# EAGLE design OLM-periph-ether_v0.2 (EAGLE 6.4)
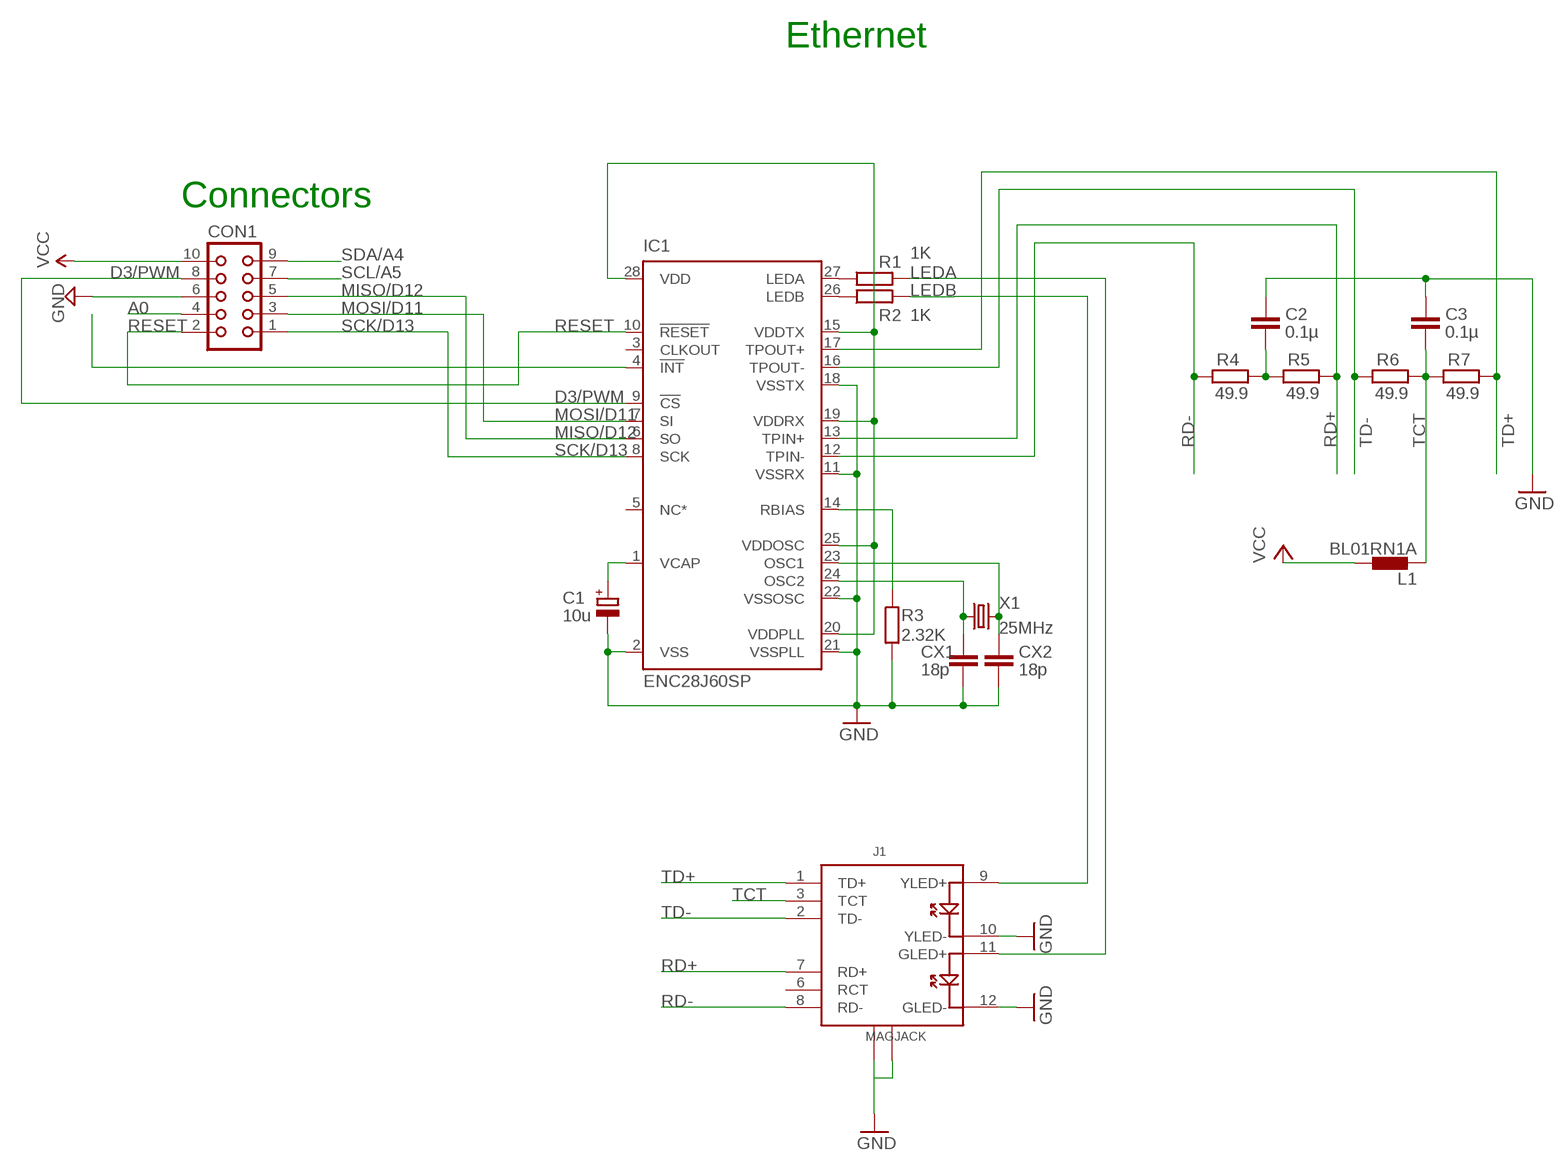
[diagram p0: schematic, sheet 1]

## Parts
C1  10u  CPOL-EUE1.8-4  [E1,8-4]
C2  0.1µ  C-EU025-024X044  [C025-024X044]
C3  0.1µ  C-EU025-024X044  [C025-024X044]
CON1  CON10L  [CON10L]
CX1  18p  C-EU025-024X044  [C025-024X044]
CX2  18p  C-EU025-024X044  [C025-024X044]
IC1  ENC28J60SP  [DIL28-3]
J1  MAGJACK  [MAGJACK]
L1  BL01RN1A  [BL01RN1A]
R1  1K  R-EU_0204/7  [0204/7]
R2  1K  R-EU_0204/7  [0204/7]
R3  2.32K  R-EU_0204/7  [0204/7]
R4  49.9  R-EU_0204/7  [0204/7]
R5  49.9  R-EU_0204/7  [0204/7]
R6  49.9  R-EU_0204/7  [0204/7]
R7  49.9  R-EU_0204/7  [0204/7]
X1  25MHz  CRYSTALHC49US  [HC49US]

## Nets
A0: CON1.4
D3/PWM: CON1.8 IC1.9(!CS)
GND [power]: C1.- C2.1 C3.1 CON1.6 CX1.2 CX2.2 IC1.2(VSS) IC1.11(VSSRX) IC1.18(VSSTX) IC1.21(VSSPLL) IC1.22(VSSOSC) J1.12(GLED-) J1.M1(GND1) J1.M2(GND2) R3.2
LEDA: J1.11(GLED+) R1.2
LEDB: J1.9(YLED+) R2.2
MISO/D12: CON1.5 IC1.6(SO)
MOSI/D11: CON1.3 IC1.7(SI)
N$1: IC1.4(!INT)
N$36: J1.10(YLED-)
N$37: IC1.27(LEDA) R1.1
N$39: IC1.26(LEDB) R2.1
N$50: C1.+ IC1.1(VCAP)
N$51: IC1.14(RBIAS) R3.1
N$52: CX1.1 IC1.24(OSC2) X1.1
N$53: CX2.1 IC1.23(OSC1) X1.2
N$54: C2.2 R4.2 R5.1
RD+: IC1.13(TPIN+) J1.7(RD+) R5.2
RD-: IC1.12(TPIN-) J1.8(RD-) R4.1
RESET: CON1.2 IC1.10(!RESET)
SCK/D13: CON1.1 IC1.8(SCK)
SCL/A5: CON1.7
SDA/A4: CON1.9
TCT: C3.2 J1.3(TCT) L1.1 R6.2 R7.1
TD+: IC1.17(TPOUT+) J1.1(TD+) R7.2
TD-: IC1.16(TPOUT-) J1.2(TD-) R6.1
VCC [power]: CON1.10 IC1.15(VDDTX) IC1.19(VDDRX) IC1.20(VDDPLL) IC1.25(VDDOSC) IC1.28(VDD) L1.2
Unconnected: IC1.3(CLKOUT) IC1.5(NC*) J1.6(RCT)

## Notes on the sheet
- Ethernet
- Connectors

## Library data of the parts
C1 = resistor:CPOL-EU: POLARIZED CAPACITOR, European symbol
C2 C3 CX1 CX2 = resistor:C-EU: CAPACITOR, European symbol
CON1 = con-harting:CON10L: CONNECTOR; OC_FARNELL: unknown; OC_NEWARK: unknown
IC1 = microchip:ENC28J60: Stand-Alone Ethernet Controller with SPI Interface Source: http://ww1.microchip.com/downloads/en/DeviceDoc/39662c.pdf; MF: MICROCHIP; MPN: ENC28J60/SP; OC_FARNELL: 1084619; OC_NEWARK: 96K3661
J1 = SparkFun:MAGJACK
L1 = inductors:BL0: Noise Suppression Products/EMI Suppression Filters, Lead EMIFIL(R) Inductor Type Source: http://www.murata.com .. BL01RN1_DS.pdf
R1-R7 = rcl:R-EU_: RESISTOR, European symbol
X1 = SparkFun:CRYSTAL: Crystals Various standard crystals. Proven footprints. Spark Fun Electronics SKU : COM-00534

## Net classes
1 power: width 0.813 mm, clearance 0.203 mm

## Board
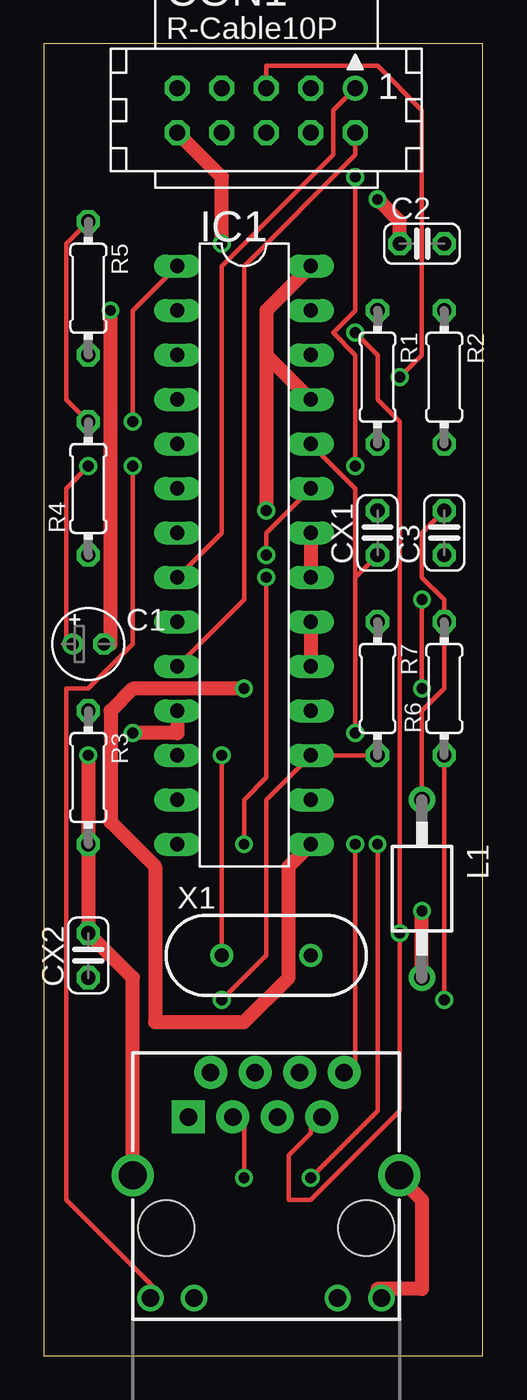
[diagram p1: board, top side]
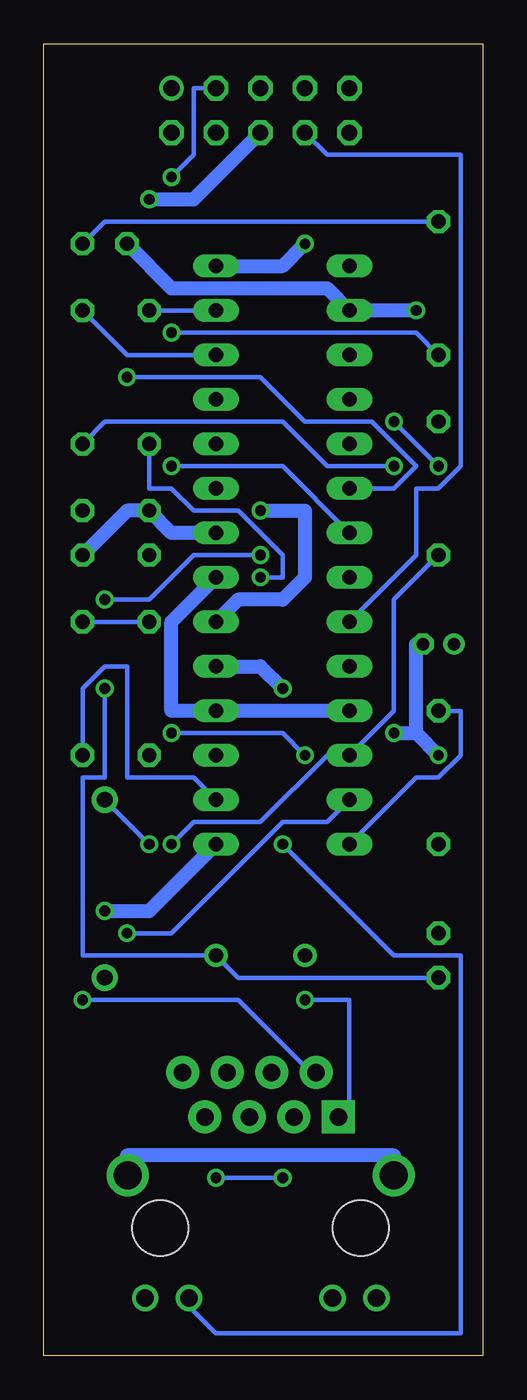
[diagram p2: board, bottom side, seen from below]

Size 25.07 x 74.92 mm. Coordinates in mm from the lower left corner, seen from the top.
Outline: 0,0 25.07,0 25.07,74.92 0,74.92 0,0
Copper layers (1*16): Top 0.035mm / dielectric 1.5mm / Bottom 0.035mm
Design rules "default": minimum track width 10mil, minimum drill 24mil, track to track 8mil, track to pad 8mil, pad to pad 8mil, via to via 8mil, smd to smd 8mil, copper to edge 40mil, drill to drill 8mil, minimum pad ring 10mil, minimum via ring 8mil, stop-mask expansion 4mil, vias tented up to drill 0mil, thermal gap 10mil

### Footprints (pad centres in the part's own frame; a part is rotated, then mirrored left to right if it is on the bottom)
E1,8-4 = drill 0.711 pad 1.168: + -0.889,0 | drill 0.711 pad 1.168 octagon: - 0.889,0
C025-024X044 = drill 0.813 octagon: 1 -1.27,0; 2 1.27,0
CON10L = drill 0.914: 1 5.08,1.27 | drill 0.914 octagon: 2 5.08,-1.27; 3 2.54,1.27; 4 2.54,-1.27; 5 0,1.27; 6 0,-1.27; 7 -2.54,1.27; 8 -2.54,-1.27; 9 -5.08,1.27; 10 -5.08,-1.27
DIL28-3 = drill 0.813 long: 1 -16.51,-3.81; 2 -13.97,-3.81; 3 -11.43,-3.81; 4 -8.89,-3.81; 5 -6.35,-3.81; 6 -3.81,-3.81; 7 -1.27,-3.81; 8 1.27,-3.81; 9 3.81,-3.81; 10 6.35,-3.81; 11 8.89,-3.81; 12 11.43,-3.81; 13 13.97,-3.81; 14 16.51,-3.81; 15 16.51,3.81; 16 13.97,3.81; 17 11.43,3.81; 18 8.89,3.81; 19 6.35,3.81; 20 3.81,3.81; 21 1.27,3.81; 22 -1.27,3.81; 23 -3.81,3.81; 24 -6.35,3.81; 25 -8.89,3.81; 26 -11.43,3.81; 27 -13.97,3.81; 28 -16.51,3.81
MAGJACK = drill 1 pad 1.88 square: 1 3.175,17.445 | drill 1 pad 1.88: 2 4.445,19.985; 3 5.715,17.445; 4 6.985,19.985; 5 8.255,17.445; 6 9.525,19.985; 7 10.795,17.445; 8 12.065,19.985 | drill 1 pad 1.27: 9 1,7.1; 10 3.5,7.1; 11 11.7,7.1; 12 14.2,7.1 | drill 1.6 pad 2.184: M1 0,14.1; M2 15.2,14.1 | hole 3.2: 1.905,11.095; 13.335,11.095
BL01RN1A = drill 0.9 pad 1.5: 1 -5.08,0; 2 5.08,0
0204/7 = drill 0.813 octagon: 1 -3.81,0; 2 3.81,0
HC49US = drill 0.813: 1 -2.54,0; 2 2.54,0

### Placement (x,y rotation side)
C1  2.54,40.64 0 top
C2  21.59,63.5 0 top
C3  22.86,46.99 90 top
CON1  12.7,71.12 0 top
CX1  19.05,46.99 90 top
CX2  2.54,22.86 90 top
IC1  11.43,45.72 270 top
J1  5.08,-3.81 0 top
L1  21.59,26.67 270 top
R1  19.05,55.88 270 top
R2  22.86,55.88 270 top
R3  2.54,33.02 270 top
R4  2.54,49.53 90 top
R5  2.54,60.96 270 top
R6  22.86,38.1 90 top
R7  19.05,38.1 270 top
X1  12.7,22.86 0 top

### Tracks (layer width: path | path; a pad name or v marks a point on that pad's centre or on a via)
D3/PWM
  Bottom 0.254: IC1.9 3.81,45.72 3.81,49.53 2.54,49.53 1.27,50.8 1.27,68.58 8.89,68.58 CON1.8
GND  (via drill 0.61)
  Top 0.813: J1.12 19.05,3.81 21.59,3.81 21.59,8.89 20.32,10.16 J1.M2 | J1.M1 5.08,21.59 CX2.2 R3.2 v2.54,34.29 | v19.05,66.04 20.32,64.77 C2.1 | IC1.22 IC1.21 | v5.08,35.56 7.62,35.56 IC1.11 | v3.81,59.69 3.81,40.64 C1.-
  Bottom 0.813: J1.M2 20.32,11.43 5.08,11.43 J1.M1 | C2.1 17.78,60.96 8.89,60.96 IC1.2 v3.81,59.69 | CON1.6 16.51,66.04 v19.05,66.04 | IC1.22 17.78,46.99 CX1.2 20.32,48.26 C3.1 | 3.81,35.56 3.81,40.64 C1.- | v5.08,35.56 3.81,35.56 | IC1.11 IC1.18 17.78,36.83 17.78,41.91 IC1.21 | 3.81,35.56 v2.54,34.29
LEDA  (via drill 0.61)
  Top 0.254: v12.7,44.45 12.7,33.02 11.43,31.75 v11.43,29.21
  Bottom 0.254: R1.2 19.05,49.53 17.78,49.53 16.51,48.26 13.97,48.26 11.43,45.72 11.43,44.45 v12.7,44.45 | v11.43,29.21 5.08,22.86 1.27,22.86 1.27,1.27 15.24,1.27 16.51,2.54 J1.11
LEDB  (via drill 0.61)
  Top 0.254: v5.08,50.8 5.08,40.64 2.54,38.1 1.27,38.1 1.27,8.89 6.35,3.81 J1.9
  Bottom 0.254: R2.2 21.59,53.34 11.43,53.34 8.89,50.8 v5.08,50.8
MISO/D12  (via drill 0.61)
  Top 0.254: v20.32,55.88 21.59,57.15 21.59,71.12 19.05,73.66 12.7,73.66 CON1.5
  Bottom 0.254: IC1.6 5.08,49.53 3.81,50.8 6.35,53.34 10.16,53.34 12.7,55.88 v20.32,55.88
MOSI/D11  (via drill 0.61)
  Top 0.254: v17.78,50.8 17.78,57.15 16.51,58.42 17.78,59.69 v17.78,67.31
  Bottom 0.254: IC1.7 11.43,50.8 v17.78,50.8 | v17.78,67.31 16.51,68.58 16.51,72.39 CON1.3
N$37
  Bottom 0.254: R1.1 IC1.27
N$39
  Bottom 0.254: IC1.26 20.32,57.15 R2.1
N$50  (via drill 0.61)
  Top 0.254: v2.54,50.8 1.27,49.53 1.27,40.64 C1.+ | v5.08,53.34 5.08,59.69 IC1.1
  Bottom 0.254: v5.08,53.34 v2.54,50.8
N$51
  Bottom 0.254: IC1.14 3.81,33.02 2.54,33.02 1.27,34.29 1.27,36.83 R3.1
N$52  (via drill 0.61)
  Top 0.254: v10.16,34.29 X1.1 | 17.78,44.45 v17.78,35.56 | CX1.1 17.78,44.45 | IC1.24 17.78,49.53 17.78,44.45
  Bottom 0.254: v10.16,34.29 11.43,35.56 v17.78,35.56
N$53  (via drill 0.61)
  Top 0.254: IC1.23 12.7,46.99 v12.7,45.72 | v21.59,38.1 v21.59,43.18
  Bottom 0.254: CX2.1 13.97,21.59 X1.2 22.86,22.86 22.86,33.02 21.59,33.02 v21.59,38.1 | v12.7,45.72 16.51,45.72 19.05,43.18 v21.59,43.18
N$54
  Top 0.254: R4.2 1.27,54.61 1.27,63.5 R5.1
  Bottom 0.254: C2.2 21.59,64.77 R5.1
RD+  (via drill 0.61)
  Top 0.254: J1.7 15.24,13.97 15.24,12.7 13.97,11.43 13.97,8.89 15.24,8.89 20.32,13.97 v20.32,24.13 20.32,53.34 19.05,54.61 19.05,57.15 v17.78,58.42
  Bottom 0.254: IC1.13 8.89,30.48 11.43,30.48 17.78,24.13 v20.32,24.13 | R5.2 3.81,58.42 v17.78,58.42
RD-  (via drill 0.61)
  Top 0.254: v17.78,29.21 17.78,16.51 J1.8
  Bottom 0.254: R4.1 5.08,43.18 5.08,36.83 IC1.12 8.89,34.29 12.7,30.48 16.51,30.48 v17.78,29.21
RESET
  Top 0.254: IC1.10 11.43,43.18 11.43,62.23 17.78,68.58 CON1.2
SCK/D13
  Top 0.254: IC1.8 10.16,46.99 10.16,62.23 16.51,68.58 16.51,71.12 CON1.1
TCT  (via drill 0.61)
  Top 0.254: C3.2 21.59,46.99 21.59,44.45 22.86,43.18 R6.2 22.86,38.1 21.59,36.83 L1.1 | v11.43,10.16 11.43,13.97 J1.3 | v15.24,10.16 19.05,13.97 v19.05,29.21
  Bottom 0.254: R6.2 R7.1 | v15.24,10.16 v11.43,10.16 | L1.1 v19.05,29.21
TD+  (via drill 0.61)
  Top 0.254: R7.2 IC1.17 12.7,31.75 12.7,22.86 v10.16,20.32
  Bottom 0.254: v10.16,20.32 7.62,20.32 7.62,13.97 J1.1
TD-  (via drill 0.61)
  Top 0.254: R6.1 v22.86,20.32
  Bottom 0.254: IC1.16 16.51,33.02 20.32,33.02 20.32,39.37 21.59,39.37 22.86,38.1 R6.1 | v22.86,20.32 13.97,20.32 10.16,16.51 J1.2
VCC  (via drill 0.61)
  Top 0.813: L1.2 v21.59,25.4 | IC1.20 IC1.19 | 12.7,57.15 IC1.25 | 12.7,57.15 12.7,59.69 IC1.28 | CON1.10 10.16,67.31 v10.16,63.5 | 12.7,57.15 v12.7,48.26 | IC1.15 13.97,27.94 13.97,21.59 11.43,19.05 6.35,19.05 6.35,27.94 3.81,30.48 3.81,36.83 5.08,38.1 v11.43,38.1
  Bottom 0.813: IC1.15 19.05,25.4 v21.59,25.4 | v10.16,63.5 11.43,62.23 IC1.28 | IC1.20 13.97,43.18 11.43,43.18 10.16,44.45 10.16,48.26 v12.7,48.26 | v11.43,38.1 12.7,39.37 IC1.19